# EAGLE schematic Z80_Control (EAGLE 5.12)
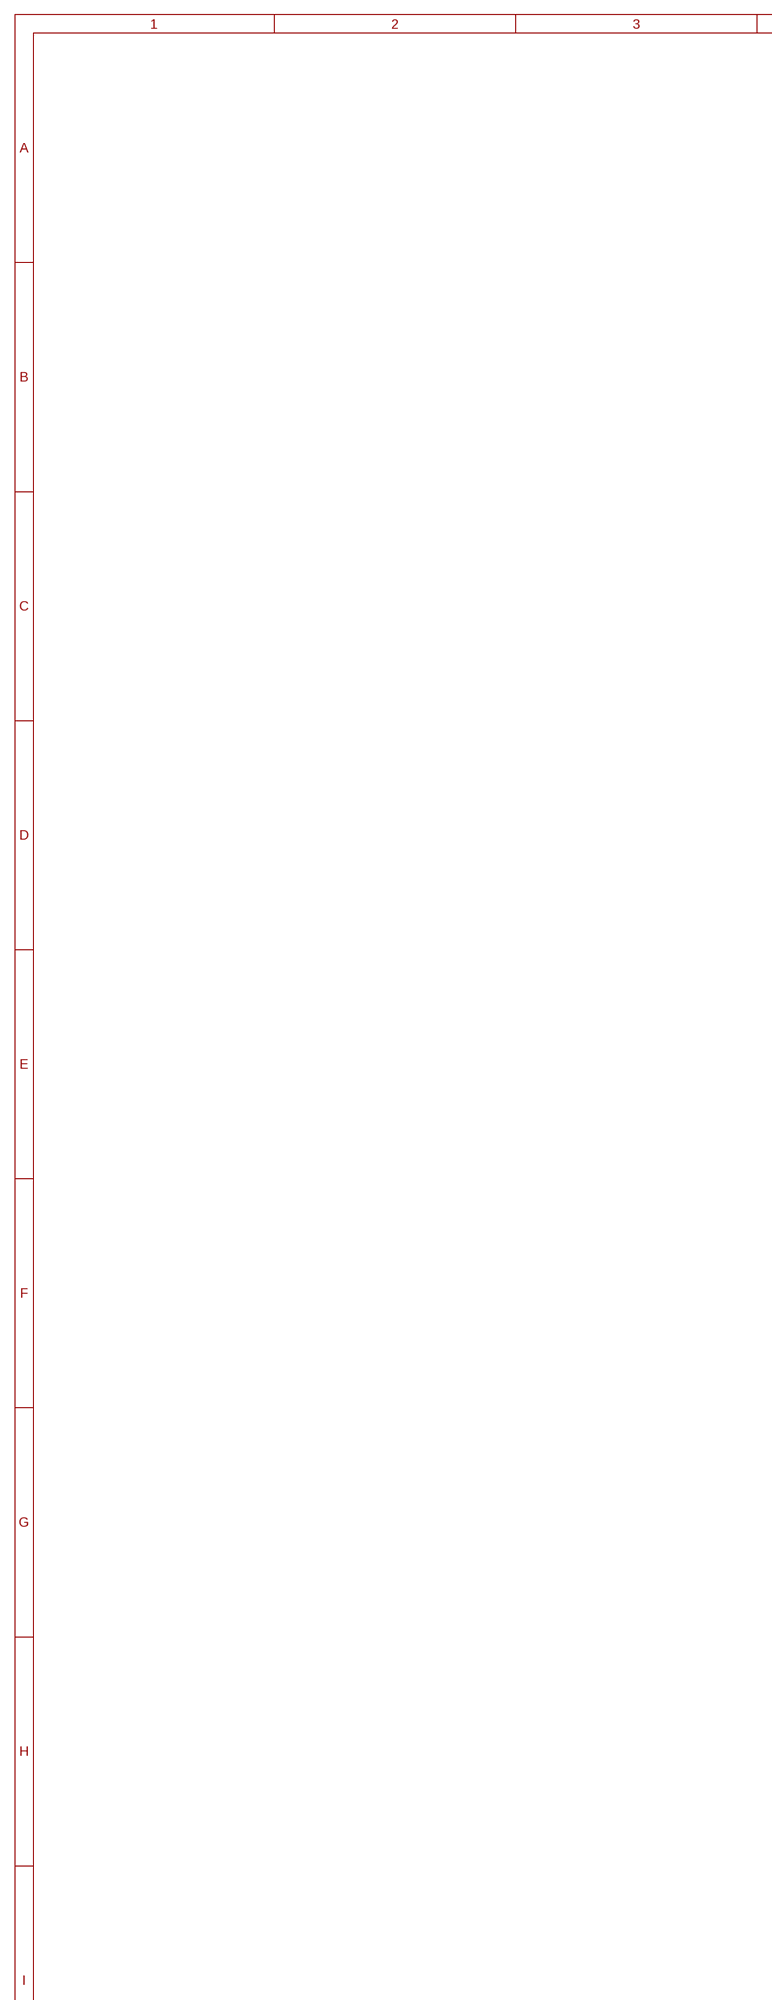
[diagram p0: schematic, sheet 1, part 1 of 2]
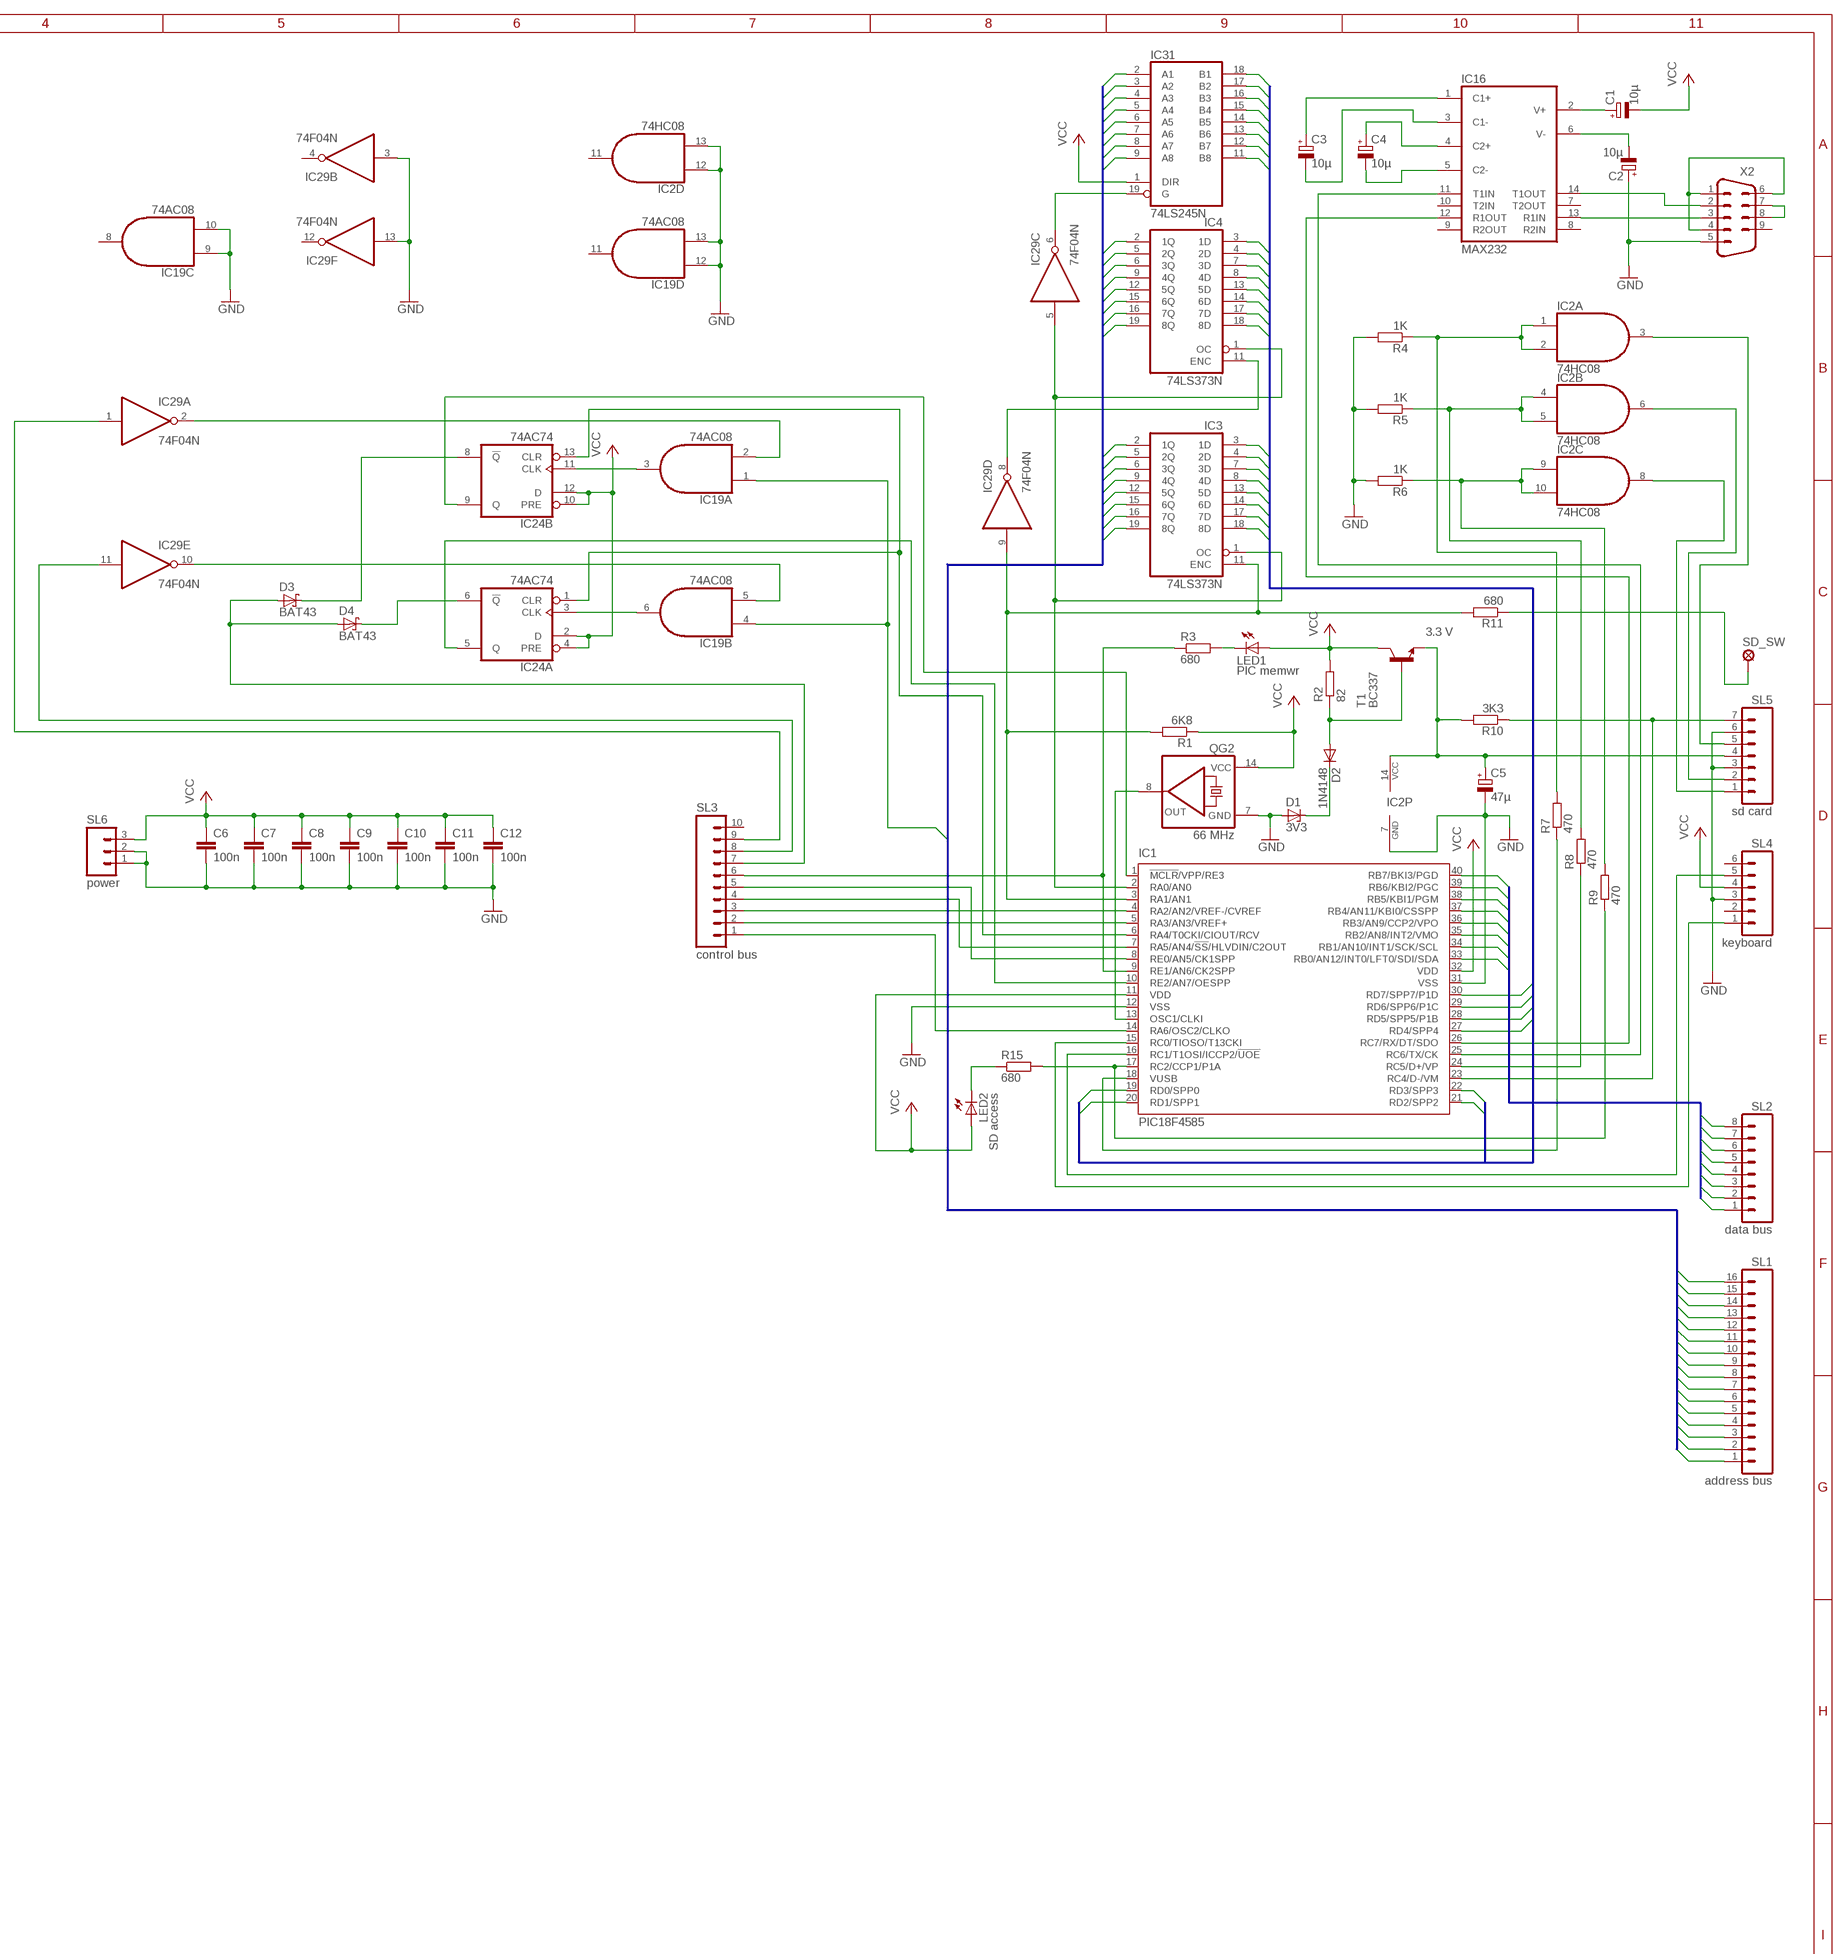
[diagram p1: schematic, sheet 1, part 2 of 2]

## Parts
C1  10µ  CPOL-EUE2.5-6  [E2,5-6]
C2  10µ  CPOL-EUE2.5-6  [E2,5-6]
C3  10µ  CPOL-EUE2.5-6  [E2,5-6]
C4  10µ  CPOL-EUE2.5-6  [E2,5-6]
C5  47µ  CPOL-EUE3.5-8  [E3,5-8]
C6  100n  C-EU050-030X075  [C050-030X075]
C7  100n  C-EU050-025X075  [C050-025X075]
C8  100n  C-EU050-030X075  [C050-030X075]
C9  100n  C-EU050-030X075  [C050-030X075]
C10  100n  C-EU050-030X075  [C050-030X075]
C11  100n  C-EU050-030X075  [C050-030X075]
C12  100n  C-EU050-030X075  [C050-030X075]
D1  3V3  BZX55  [DO35Z10]
D2  1N4148  1N4148DO35-7  [DO35-7]
D3  BAT43  BAT42  [DO35-10]
D4  BAT43  BAT42  [DO35-10]
IC1  PIC18F4585  PIC18F4455_40  [DIL40]
IC2  74HC08  74LS08N  [DIL14]
IC3  74LS373N  [DIL20]
IC4  74LS373N  [DIL20]
IC16  MAX232  [DIL16]
IC19  74AC08  74LS08N  [DIL14]
IC24  74AC74  74S74N  [DIL14]
IC29  74F04N  74AS04N  [DIL14]
IC31  74LS245N  [DIL20]
LED1  PIC memwr  LED5MM  [LED5MM]
LED2  SD access  LED5MM  [LED5MM]
QG2  66 MHz  QG5860  [DIL14S]
R1  6K8  R-EU_0207/10  [0207/10]
R2  82  R-EU_0207/10  [0207/10]
R3  680  R-EU_0207/10  [0207/10]
R4  1K  R-EU_0207/10  [0207/10]
R5  1K  R-EU_0207/10  [0207/10]
R6  1K  R-EU_0207/10  [0207/10]
R7  470  R-EU_0207/10  [0207/10]
R8  470  R-EU_0207/10  [0207/10]
R9  470  R-EU_0207/10  [0207/10]
R10  3K3  R-EU_0207/10  [0207/10]
R11  680  R-EU_0207/10  [0207/10]
R15  680  R-EU_0207/10  [0207/10]
SD_SW  LSP10  [LSP10]
SL1  address bus  M16  [16P]
SL2  data bus  M08  [08P]
SL3  control bus  M10  [10P]
SL4  keyboard  M06  [06P]
SL5  sd card  M07  [07P]
SL6  power  M03  [03P]
T1  BC337  BC337-40-NPN-TO92-EBC  [TO92-EBC]
X2  M09HP  [M09HP]

## Nets
/ADDR_WR: IC1.2(RA0/AN0) IC3.1(OC) IC4.1(OC) IC29.5(C:I)
/BUSRQ: IC1.4(RA2/AN2/VREF-/CVREF) SL3.3
/CLR_WAIT: IC1.6(RA4/T0CKI/CIOUT/RCV) IC24.1(A:CLR) IC24.13(B:CLR)
/INT: IC1.7(RA5/AN4/!SS!/HLVDIN/C2OUT) SL3.4
/IORD: IC29.1(A:I) SL3.9
/IOWR: IC29.11(E:I) SL3.8
/MEMRD_PIC: IC1.8(RE0/AN5/CK1SPP) SL3.5
/MEMWR_PIC: IC1.9(RE1/AN6/CK2SPP) R3.1 SL3.6
/RESET: IC1.14(RA6/OSC2/CLKO) SL3.1
/SD_CS: IC1.17(RC2/CCP1/P1A) R9.1 R15.2
/SD_CS3: IC2.9(C:I0) IC2.10(C:I1) R6.1 R9.2
/SD_CS3_B: IC2.8(C:O) SL5.1
/WAIT1: D4.C IC24.6(A:!Q)
/WAIT2: D3.C IC24.8(B:!Q)
/WAIT_1_2: D3.A D4.A SL3.7
AB0: IC4.2(1Q) IC31.2(A1) SL1.1
AB1: IC4.5(2Q) IC31.3(A2) SL1.2
AB2: IC4.6(3Q) IC31.4(A3) SL1.3
AB3: IC4.9(4Q) IC31.5(A4) SL1.4
AB4: IC4.12(5Q) IC31.6(A5) SL1.5
AB5: IC4.15(6Q) IC31.7(A6) SL1.6
AB6: IC4.16(7Q) IC31.8(A7) SL1.7
AB7: IC4.19(8Q) IC19.1(A:I0) IC19.4(B:I0) IC31.9(A8) SL1.8
AB8: IC3.2(1Q) SL1.9
AB9: IC3.5(2Q) SL1.10
AB10: IC3.6(3Q) SL1.11
AB11: IC3.9(4Q) SL1.12
AB12: IC3.12(5Q) SL1.13
AB13: IC3.15(6Q) SL1.14
AB14: IC3.16(7Q) SL1.15
AB15: IC3.19(8Q) SL1.16
ADDR_WR: IC29.6(C:O) IC31.19(G)
BUSAK_RESET: IC1.5(RA3/AN3/VREF+) SL3.2
CLK_PIC: IC1.13(OSC1/CLKI) QG2.8(OUT)
CTRL_RD: IC1.1(!MCLR!/VPP/RE3) IC24.9(B:Q)
CTRL_WR: IC1.10(RE2/AN7/OESPP) IC24.5(A:Q)
DB0: IC1.33(RB0/AN12/INT0/LFT0/SDI/SDA) SL2.1
DB1: IC1.34(RB1/AN10/INT1/SCK/SCL) SL2.2
DB2: IC1.35(RB2/AN8/INT2/VMO) SL2.3
DB3: IC1.36(RB3/AN9/CCP2/VPO) SL2.4
DB4: IC1.37(RB4/AN11/KBI0/CSSPP) SL2.5
DB5: IC1.38(RB5/KBI1/PGM) SL2.6
DB6: IC1.39(RB6/KBI2/PGC) SL2.7
DB7: IC1.40(RB7/BKI3/PGD) SL2.8
GND: C2.+ C5.- C6.2 C7.2 C8.2 C9.2 C10.2 C11.2 C12.2 D1.A IC1.12(VSS) IC1.31(VSS) IC2.7(P:GND) IC2.12(D:I0) IC2.13(D:I1) IC19.9(C:I0) IC19.10(C:I1) IC19.12(D:I0) IC19.13(D:I1) IC29.3(B:I) IC29.13(F:I) QG2.7(GND) R4.2 R5.2 R6.2 SL4.3 SL5.3 SL5.6 SL6.1 SL6.2 X2.5
IORD: IC19.2(A:I1) IC29.2(A:O)
IOWR: IC19.5(B:I1) IC29.10(E:O)
IOWR_PIC: IC19.6(B:O) IC24.3(A:CLK)
IOWR_PIC1: IC19.3(A:O) IC24.11(B:CLK)
KEYB_CLOCK: IC1.16(RC1/T1OSI/ICCP2/!UOE) SL4.5
KEYB_DATA: IC1.15(RC0/TIOSO/T13CKI) SL4.1
LD_HI_ADDR: IC1.3(RA1/AN1) IC3.11(ENC) IC29.9(D:I) R1.2 R11.2
LD_LO_ADDR: IC4.11(ENC) IC29.8(D:O)
N$1: R11.1 SD_SW.MP
N$2: D1.C D2.C
N$5: D2.A R2.1 T1.B
N$7: LED1.K(C) R3.2
N$9: LED2.K(C) R15.1
N$10: C4.- IC16.5(C2-)
N$32: C4.+ IC16.4(C2+)
N$34: C3.- IC16.3(C1-)
N$35: C3.+ IC16.1(C1+)
N$36: C2.- IC16.6(V-)
N$37: C1.+ IC16.2(V+)
N$40: X2.1 X2.4 X2.6
N$42: X2.7 X2.8
PA0: IC1.19(RD0/SPP0) IC3.3(1D) IC4.3(1D) IC31.18(B1)
PA1: IC1.20(RD1/SPP1) IC3.4(2D) IC4.4(2D) IC31.17(B2)
PA2: IC1.21(RD2/SPP2) IC3.7(3D) IC4.7(3D) IC31.16(B3)
PA3: IC1.22(RD3/SPP3) IC3.8(4D) IC4.8(4D) IC31.15(B4)
PA4: IC1.27(RD4/SPP4) IC3.13(5D) IC4.13(5D) IC31.14(B5)
PA5: IC1.28(RD5/SPP5/P1B) IC3.14(6D) IC4.14(6D) IC31.13(B6)
PA6: IC1.29(RD6/SPP6/P1C) IC3.17(7D) IC4.17(7D) IC31.12(B7)
PA7: IC1.30(RD7/SPP7/P1D) IC3.18(8D) IC4.18(8D) IC31.11(B8)
RS232_RX: IC16.13(R1IN) X2.3
RS232_TX: IC16.14(T1OUT) X2.2
SD_SCK: IC1.18(VUSB) R7.1
SD_SCK3: IC2.1(A:I0) IC2.2(A:I1) R4.1 R7.2
SD_SCK3_B: IC2.3(A:O) SL5.5
SD_SDI: IC1.23(RC4/D-/VM) R10.1 SL5.7
SD_SDO: IC1.24(RC5/D+/VP) R8.1
SD_SDO3: IC2.4(B:I0) IC2.5(B:I1) R5.1 R8.2
SD_SDO3_B: IC2.6(B:O) SL5.2
USART_RX: IC1.26(RC7/RX/DT/SDO) IC16.12(R1OUT)
USART_TX: IC1.25(RC6/TX/CK) IC16.11(T1IN)
VCC: C1.- C6.1 C7.1 C8.1 C9.1 C10.1 C11.1 C12.1 IC1.11(VDD) IC1.32(VDD) IC24.2(A:D) IC24.4(A:PRE) IC24.10(B:PRE) IC24.12(B:D) IC31.1(DIR) LED1.A LED2.A QG2.14(VCC) R1.1 R2.2 SL4.4 SL6.3 T1.C
VCC3: C5.+ IC2.14(P:VCC) R10.2 SL5.4 T1.E
Unconnected: IC2.11(D:O) IC16.7(T2OUT) IC16.8(R2IN) IC16.9(R2OUT) IC16.10(T2IN) IC19.8(C:O) IC19.11(D:O) IC29.4(B:O) IC29.12(F:O) SL3.10 SL4.2 SL4.6 X2.9

## Buses
AB[0..15]
DB[0..7]
PA[0..7]

## Notes on the sheet
- 3.3 V

## Power pins joined to a net without a drawn wire
GND: IC3.10(GND) IC4.10(GND) IC16.15(GND) IC19.7(P:GND) IC24.7(P:GND) IC29.7(P:GND) IC31.10(GND)
VCC: IC3.20(VCC) IC4.20(VCC) IC16.16(VCC) IC19.14(P:VCC) IC24.14(P:VCC) IC29.14(P:VCC) IC31.20(VCC)

## Library data of the parts
C1-C5 = rcl:CPOL-EU: POLARIZED CAPACITOR, European symbol
C6-C12 = rcl:C-EU: CAPACITOR, European symbol
D1 = diode:BZX55: Z DIODE
D2 = diode:1N4148: DIODE high speed (Philips)
D3 D4 = diode:BAT42: DIODE barrier diode
IC1 = microchip:PIC18F4*_40: USB Microcontrollers with nanoWatt Technology High-Performance, Enhanced Flash, 28/40/44-Pin, Source: http://ww1.microchip.com/downloads/en/devicedoc/39632c.pdf
IC2 IC19 = 74xx-us:74*08: Quad 2-input AND gate
IC3 IC4 = 74xx-us:74*373: Octal D type transparent LATCH, edge triggered
IC16 = maxim:MAX232: RS232 TRANSEIVER
IC24 = 74xx-us:74*74: Dual D type positive edge triggered FLIP FLOP, preset and clear
IC29 = 74xx-us:74*04: Hex INVERTER
IC31 = 74xx-us:74*245: Octal BUS TRANSCEIVER, 3-state
LED1 LED2 = led:LED: LED OSRAM: - CHIPLED LG R971, LG N971, LY N971, LG Q971, LY Q971, LO R971, LY R971 LH N974, LH R974 LS Q976, LO Q976, LY Q976 LO Q996 - Hyper CHIPLED LW Q18S LB Q993, LB Q99A, LB R99A - SideLED LS A670, LO A670, LY A670, LG A670, LP A670 LB A673, LV A673, LT A673, LW A673 LH A674 LY A675 LS A676, LA A676, LO A676, LY A676, LW A676 LS A679, LY A679, LG A679 - Hyper Micro SIDELED® LS Y876, LA Y876, LO Y876, LY Y876 LT Y87S - SmartLED LW L88C, LW L88S LB L89C, LB L89S, LG L890 LS L89K, LO L89K, LY L89K LS L896, LA L896, LO L896, LY L896 - TOPLED LS T670, LO T670, LY T670, LG T670, LP T670 LSG T670, LSP T670, LSY T670, LOP T670, LYG T670 LG T671, LOG T671, LSG T671 LB T673, LV T673, LT T673, LW T673 LH T674 LS T676, LA T676, LO T676, LY T676, LB T676, LH T676, LSB T676, LW T676 LB T67C, LV T67C, LT T67C, LS T67K, LO T67K, LY T67K, LW E67C LS E67B, LA E67B, LO E67B, LY E67B, LB E67C, LV E67C, LT E67C LW T67C LS T679, LY T679, LG T679 LS T770, LO T770, LY T770, LG T770, LP T770 LB T773, LV T773, LT T773, LW T773 LH T774 LS E675, LA E675, LY E675, LS T675 LS T776, LA T776, LO T776, LY T776, LB T776 LHGB T686 LT T68C, LB T68C - Hyper Mini TOPLED® LB M676 - Mini TOPLED Santana® LG M470 LS M47K, LO M47K, LY M47K Source: http://www.osram.convergy.de LUXEON: - LUMILED® LXK2-PW12-R00, LXK2-PW12-S00, LXK2-PW14-U00, LXK2-PW14-V00 LXK2-PM12-R00, LXK2-PM12-S00, LXK2-PM14-U00 LXK2-PE12-Q00, LXK2-PE12-R00, LXK2-PE12-S00, LXK2-PE14-T00, LXK2-PE14-U00 LXK2-PB12-K00, LXK2-PB12-L00, LXK2-PB12-M00, LXK2-PB14-N00, LXK2-PB14-P00, LXK2-PB14-Q00 LXK2-PR12-L00, LXK2-PR12-M00, LXK2-PR14-Q00, LXK2-PR14-R00 LXK2-PD12-Q00, LXK2-PD12-R00, LXK2-PD12-S00 LXK2-PH12-R00, LXK2-PH12-S00 LXK2-PL12-P00, LXK2-PL12-Q00, LXK2-PL12-R00 Source: www.luxeon.com KINGBRIGHT: KA-3528ASYC Source: www.kingbright.com
QG2 = crystal:QG5860: CRYSTAL RESONATOR
R1-R11 R15 = rcl:R-EU_: RESISTOR, European symbol
SD_SW = solpad:LSP10: SOLDER PAD drill 1.0 mm, distributor Buerklin, 12H555
SL1 = con-amp-quick:M16: AMP QUICK CONNECTOR
SL2 = con-amp-quick:M08: AMP QUICK CONNECTOR
SL3 = con-amp-quick:M10: AMP QUICK CONNECTOR
SL4 = con-amp-quick:M06: AMP QUICK CONNECTOR
SL5 = con-amp-quick:M07: AMP QUICK CONNECTOR
SL6 = con-amp-quick:M03: AMP QUICK CONNECTOR
T1 = transistor:*-NPN-: NPN Transistror BF959 corrected 2008.03.06
X2 = con-subd:M09: SUB-D